# EAGLE design EIB A79024-001 (EAGLE 9.3.2)
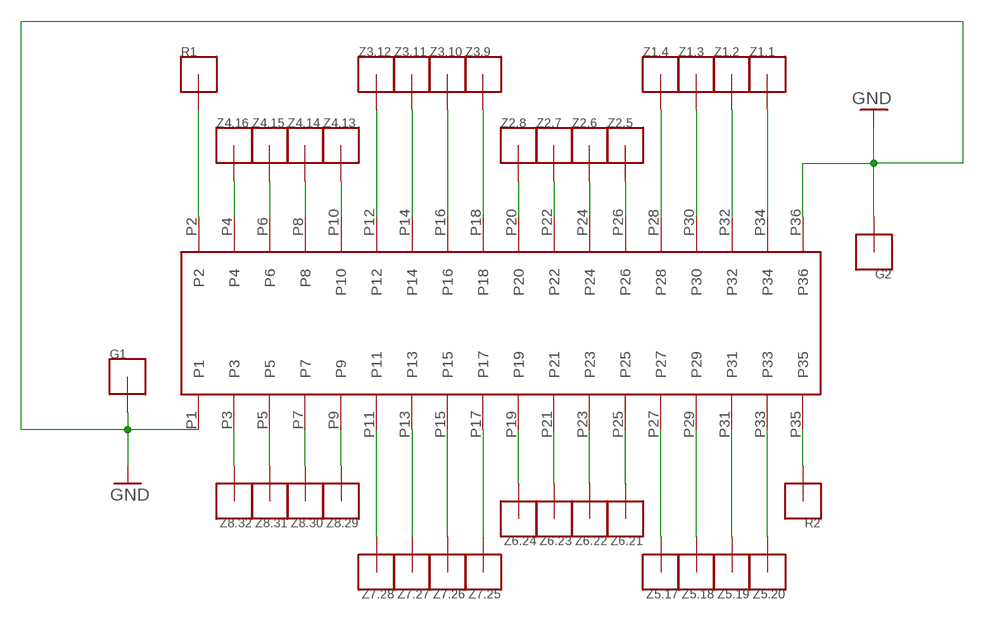
[diagram p0: schematic, sheet 1]

## Parts
A79024  OMNETICS  [A79024]
G1  S_P_HOLE  [S_P_HOLE]
G2  S_P_HOLE  [S_P_HOLE]
R1  S_P_HOLE  [S_P_HOLE]
R2  S_P_HOLE  [S_P_HOLE]
Z1.1  S_P_HOLE  [S_P_HOLE]
Z1.2  S_P_HOLE  [S_P_HOLE]
Z1.3  S_P_HOLE  [S_P_HOLE]
Z1.4  S_P_HOLE  [S_P_HOLE]
Z2.5  S_P_HOLE  [S_P_HOLE]
Z2.6  S_P_HOLE  [S_P_HOLE]
Z2.7  S_P_HOLE  [S_P_HOLE]
Z2.8  S_P_HOLE  [S_P_HOLE]
Z3.9  S_P_HOLE  [S_P_HOLE]
Z3.10  S_P_HOLE  [S_P_HOLE]
Z3.11  S_P_HOLE  [S_P_HOLE]
Z3.12  S_P_HOLE  [S_P_HOLE]
Z4.13  S_P_HOLE  [S_P_HOLE]
Z4.14  S_P_HOLE  [S_P_HOLE]
Z4.15  S_P_HOLE  [S_P_HOLE]
Z4.16  S_P_HOLE  [S_P_HOLE]
Z5.17  S_P_HOLE  [S_P_HOLE]
Z5.18  S_P_HOLE  [S_P_HOLE]
Z5.19  S_P_HOLE  [S_P_HOLE]
Z5.20  S_P_HOLE  [S_P_HOLE]
Z6.21  S_P_HOLE  [S_P_HOLE]
Z6.22  S_P_HOLE  [S_P_HOLE]
Z6.23  S_P_HOLE  [S_P_HOLE]
Z6.24  S_P_HOLE  [S_P_HOLE]
Z7.25  S_P_HOLE  [S_P_HOLE]
Z7.26  S_P_HOLE  [S_P_HOLE]
Z7.27  S_P_HOLE  [S_P_HOLE]
Z7.28  S_P_HOLE  [S_P_HOLE]
Z8.29  S_P_HOLE  [S_P_HOLE]
Z8.30  S_P_HOLE  [S_P_HOLE]
Z8.31  S_P_HOLE  [S_P_HOLE]
Z8.32  S_P_HOLE  [S_P_HOLE]

## Nets
GND: A79024.P1 A79024.P36 G1.P1 G2.P1
N$1: A79024.P20 Z2.8.P1
N$2: A79024.P22 Z2.7.P1
N$3: A79024.P24 Z2.6.P1
N$4: A79024.P26 Z2.5.P1
N$5: A79024.P4 Z4.16.P1
N$6: A79024.P6 Z4.15.P1
N$7: A79024.P8 Z4.14.P1
N$8: A79024.P10 Z4.13.P1
N$9: A79024.P12 Z3.12.P1
N$10: A79024.P14 Z3.11.P1
N$11: A79024.P16 Z3.10.P1
N$12: A79024.P18 Z3.9.P1
N$13: A79024.P28 Z1.4.P1
N$14: A79024.P30 Z1.3.P1
N$15: A79024.P32 Z1.2.P1
N$16: A79024.P34 Z1.1.P1
N$17: A79024.P2 R1.P1
N$18: A79024.P35 R2.P1
N$19: A79024.P3 Z8.32.P1
N$20: A79024.P5 Z8.31.P1
N$21: A79024.P7 Z8.30.P1
N$22: A79024.P9 Z8.29.P1
N$23: A79024.P11 Z7.28.P1
N$24: A79024.P13 Z7.27.P1
N$25: A79024.P15 Z7.26.P1
N$26: A79024.P17 Z7.25.P1
N$27: A79024.P19 Z6.24.P1
N$28: A79024.P21 Z6.23.P1
N$29: A79024.P23 Z6.22.P1
N$30: A79024.P25 Z6.21.P1
N$31: A79024.P27 Z5.17.P1
N$32: A79024.P29 Z5.18.P1
N$33: A79024.P31 Z5.19.P1
N$34: A79024.P33 Z5.20.P1

## Library data of the parts
A79024 = omnetics:OMNETICS
G1 G2 R1 R2 Z1.1-Z1.4 Z2.5-Z2.8 Z3.9-Z3.12 Z4.13-Z4.16 Z5.17-Z5.20 Z6.21-Z6.24 Z7.25-Z7.28 Z8.29-Z8.32 = omnetics:S_P_HOLE

## Board
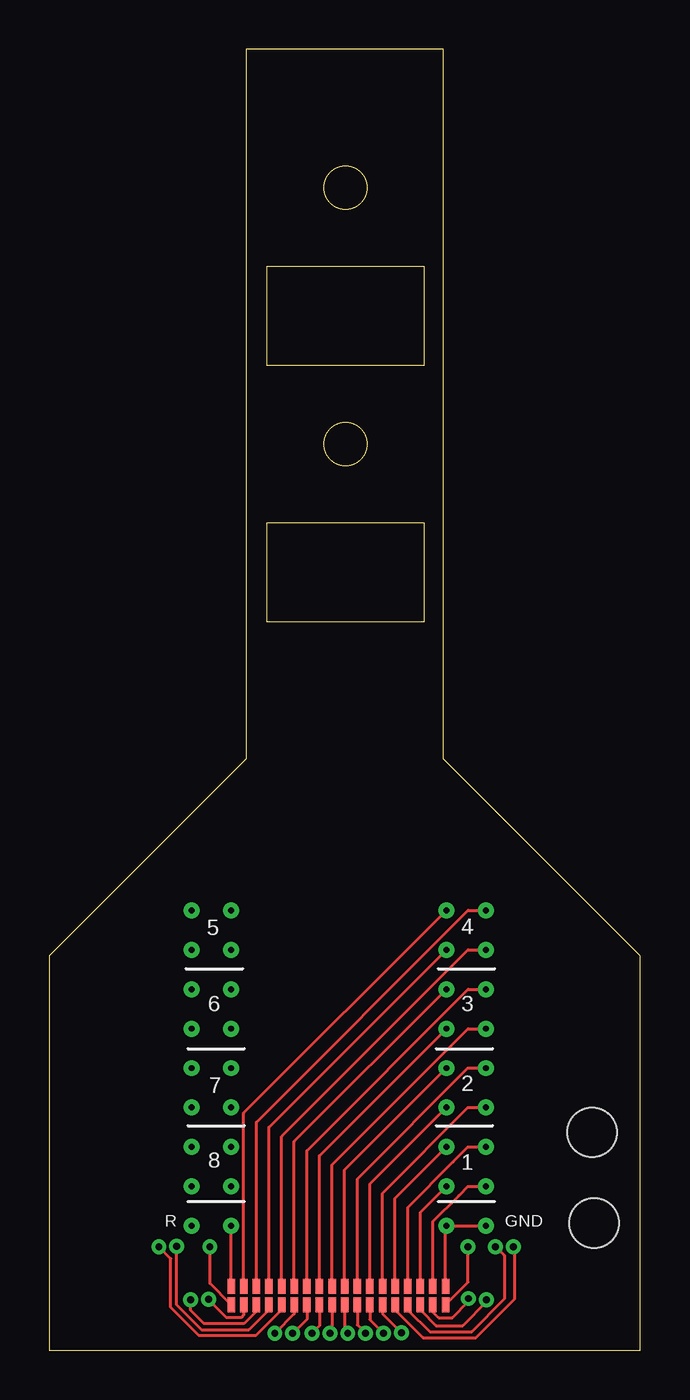
[diagram p1: board, top side]
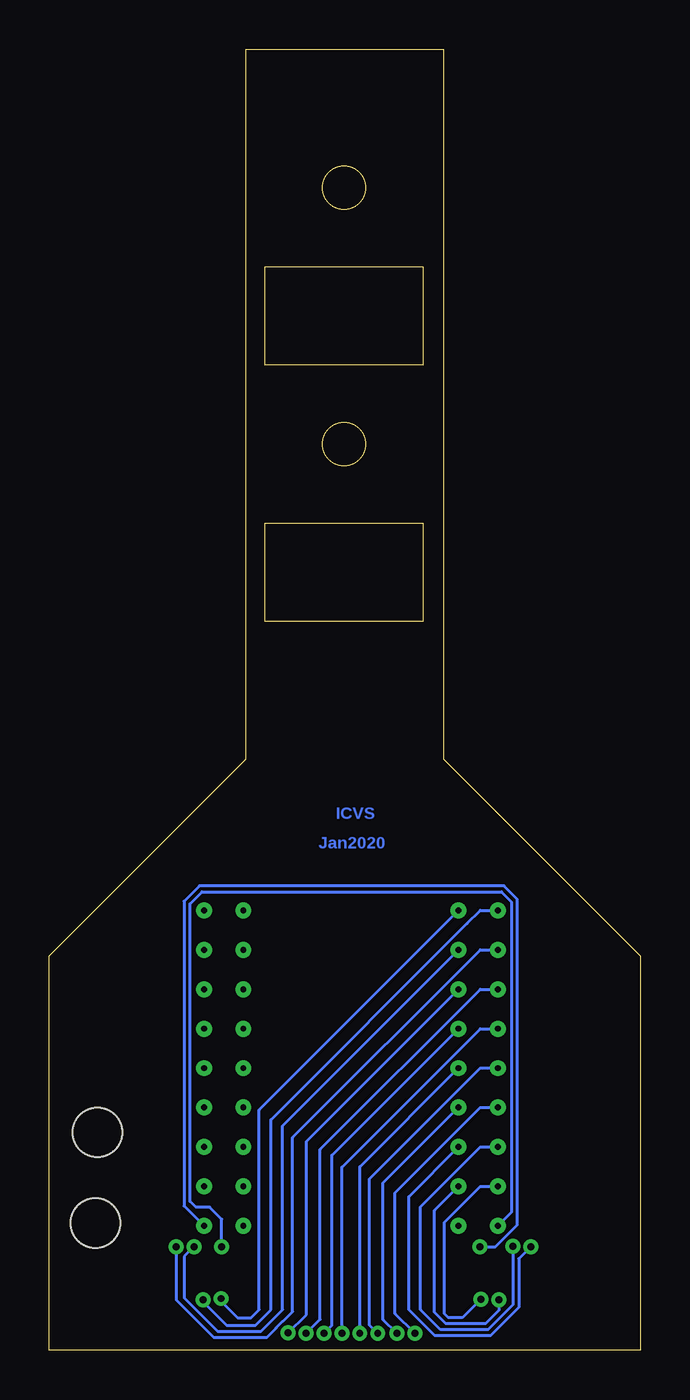
[diagram p2: board, bottom side, seen from below]

Size 30 x 66 mm. Coordinates in mm from the lower left corner, seen from the top.
Outline: 19.04,36.97 19.04,41.97 11.04,41.97 11.04,36.97 19.04,36.97
Outline: 19.04,49.97 19.04,54.97 11.04,54.97 11.04,49.97 19.04,49.97
Outline: 10,30 0,20 0,0 30,0 30,20 20,30 20,66 10,66 10,30
Outline: circle at 15.04,45.97 radius 1.1
Outline: circle at 15.04,58.97 radius 1.1
Copper layers (1*16): Top 0.035mm / dielectric 1.5mm / Bottom 0.035mm
Design rules "default": minimum track width 6mil, minimum drill 0.35mm, track to track 6mil, track to pad 6mil, pad to pad 6mil, via to via 6mil, smd to smd 6mil, copper to edge 40mil, drill to drill 6mil, minimum pad ring 10mil, minimum via ring 8mil, stop-mask expansion 4mil, vias tented up to drill 0mil, thermal gap 10mil
Holes 2.5 mm at 27.55,11.05 27.65,6.45

### Footprints (pad centres in the part's own frame; a part is rotated, then mirrored left to right if it is on the bottom)
A79024 = smd 0.38 x 0.76: P1 0,0; P2 0,0.94; P3 0.64,0; P4 0.64,0.94; P5 1.28,0; P6 1.28,0.94; P7 1.92,0; P8 1.92,0.94; P9 2.56,0; P10 2.56,0.94; P11 3.2,0; P12 3.2,0.94; P13 3.84,0; P14 3.84,0.94; P15 4.48,0; P16 4.48,0.94; P17 5.12,0; P18 5.12,0.94; P19 5.76,0; P20 5.76,0.94; P21 6.4,0; P22 6.4,0.94; P23 7.04,0; P24 7.04,0.94; P25 7.68,0; P26 7.68,0.94; P27 8.32,0; P28 8.32,0.94; P29 8.96,0; P30 8.96,0.94; P31 9.6,0; P32 9.6,0.94; P33 10.24,0; P34 10.24,0.94; P35 10.88,0; P36 10.88,0.94
S_P_HOLE = drill 0.3 pad 0.6: P1 0,0

### Placement (x,y rotation side)
A79024  9.23,2.31 0 top
G1  22.15,6.31 0 top
G2  20.15,6.31 0 top
R1  9.23,6.31 0 top
R2  7.23,6.31 0 top
Z1.1  22.15,8.31 0 top
Z1.2  20.15,8.31 0 top
Z1.3  22.15,10.31 0 top
Z1.4  20.15,10.31 0 top
Z2.5  22.15,12.31 0 top
Z2.6  20.15,12.31 0 top
Z2.7  22.15,14.31 0 top
Z2.8  20.15,14.31 0 top
Z3.9  22.15,16.31 0 top
Z3.10  20.15,16.31 0 top
Z3.11  22.15,18.31 0 top
Z3.12  20.15,18.31 0 top
Z4.13  22.15,20.31 0 top
Z4.14  20.15,20.31 0 top
Z4.15  22.15,22.31 0 top
Z4.16  20.15,22.31 0 top
Z5.17  7.23,20.31 0 top
Z5.18  9.23,20.31 0 top
Z5.19  7.23,22.31 0 top
Z5.20  9.23,22.31 0 top
Z6.21  9.23,18.31 0 top
Z6.22  7.23,18.31 0 top
Z6.23  9.23,16.31 0 top
Z6.24  7.23,16.31 0 top
Z7.25  9.23,14.31 0 top
Z7.26  7.23,14.31 0 top
Z7.27  9.23,12.31 0 top
Z7.28  7.23,12.31 0 top
Z8.29  9.23,10.31 0 top
Z8.30  7.23,10.31 0 top
Z8.31  9.23,8.31 0 top
Z8.32  7.23,8.31 0 top

### Tracks (layer width: path | path; a pad name or v marks a point on that pad's centre or on a via)
GND  (via drill 0.35)
  Top 0.152: A79024.P36 20.11,6.27 G2.P1 G1.P1 | A79024.P1 8.15,3.39 v8.15,5.25
  Bottom 0.152: v8.15,5.25 7.35,5.25 6.25,6.36 6.25,22.88 6.93,23.56 22.38,23.56 23.16,22.78 23.16,7.32 G1.P1
N$1
  Top 0.152: A79024.P20 14.99,9.15 Z2.8.P1
N$2
  Top 0.152: Z2.7.P1 21.26,14.31 15.63,8.69 A79024.P22
N$3
  Top 0.152: A79024.P24 16.27,8.43 Z2.6.P1
N$4
  Top 0.152: Z2.5.P1 21.26,12.31 16.91,7.97 A79024.P26
N$5
  Top 0.152: A79024.P4 9.87,12.03 Z4.16.P1
N$6
  Top 0.152: Z4.15.P1 21.26,22.31 10.51,11.57 A79024.P6
N$7
  Top 0.152: A79024.P8 11.15,11.31 Z4.14.P1
N$8
  Top 0.152: Z4.13.P1 21.26,20.31 11.79,10.85 A79024.P10
N$9
  Top 0.152: A79024.P12 12.43,10.59 Z3.12.P1
N$10
  Top 0.152: Z3.11.P1 21.26,18.31 13.07,10.13 A79024.P14
N$11
  Top 0.152: A79024.P16 13.71,9.87 Z3.10.P1
N$12
  Top 0.152: Z3.9.P1 21.26,16.31 14.35,9.41 A79024.P18
N$13
  Top 0.152: A79024.P28 17.55,7.71 Z1.4.P1
N$14
  Top 0.152: Z1.3.P1 21.25,10.31 20.48,9.55 20.49,9.55 18.19,7.25 A79024.P30
N$15
  Top 0.152: A79024.P32 18.83,6.99 Z1.2.P1
N$16
  Top 0.152: Z1.1.P1 21.25,8.31 20.78,7.85 20.79,7.85 19.47,6.53 A79024.P34
N$17
  Top 0.152: A79024.P2 R1.P1
N$18  (via drill 0.35)
  Top 0.152: A79024.P35 21.25,3.45 v21.25,5.25
  Bottom 0.152: v21.25,5.25 21.25,6.65 21.85,7.25 22.55,7.25 22.85,7.55 22.85,22.65 22.25,23.25 7.05,23.25 6.55,22.75 6.55,6.99 R2.P1
N$19  (via drill 0.35)
  Top 0.152: A79024.P3 9.87,1.77 9.75,1.65 9,1.65 8.09,2.56 v8.09,2.59
  Bottom 0.152: v8.09,2.59 9.03,1.65 9.75,1.65 9.95,1.85 9.95,6.49 8.13,8.31 Z8.32.P1
N$20  (via drill 0.35)
  Top 0.152: A79024.P5 10.49,2.29 10.49,1.96 9.88,1.35 8.87,1.35 7.85,1.35 7.18,2.02 v7.18,2.55
  Bottom 0.152: v7.18,2.55 7.18,2.02 7.86,1.35 9.88,1.35 10.45,1.92 10.45,7.09 Z8.31.P1
N$21  (via drill 0.35)
  Top 0.152: A79024.P7 11.15,2.01 11.13,1.99 11.13,2.04 10.14,1.04 7.73,1.04 6.47,2.3 v6.47,5.27
  Bottom 0.152: v6.47,5.27 6.47,2.3 7.73,1.04 10.14,1.04 11.15,2.05 11.15,7.29 9.49,8.95 9.5,8.95 8.13,10.31 Z8.30.P1
N$22  (via drill 0.35)
  Top 0.152: v5.56,5.25 6.17,4.65 6.17,2.18 7.6,0.74 10.47,0.74 11.79,2.06 A79024.P9
  Bottom 0.152: v5.56,5.25 6.17,4.65 6.17,2.18 7.6,0.74 10.44,0.74 11.76,2.06 11.76,7.79 Z8.29.P1
N$23  (via drill 0.35)
  Top 0.152: A79024.P11 12.43,1.84 v11.45,0.86
  Bottom 0.152: Z7.28.P1 8.13,12.31 12.45,8 12.45,1.86 v11.45,0.86
N$24  (via drill 0.35)
  Top 0.152: A79024.P13 13.07,1.56 12.56,1.04 12.55,1.04 v12.36,0.85
  Bottom 0.152: v12.36,0.85 13.05,1.55 13.05,8.49 Z7.27.P1
N$25  (via drill 0.35)
  Top 0.152: A79024.P15 13.71,1.23 v13.33,0.85
  Bottom 0.152: v13.33,0.85 13.75,1.27 13.75,8.69 8.13,14.31 Z7.26.P1
N$26  (via drill 0.35)
  Top 0.152: A79024.P17 14.35,0.96 v14.24,0.85
  Bottom 0.152: v14.24,0.85 14.24,9.3 Z7.25.P1
N$27  (via drill 0.35)
  Top 0.152: A79024.P19 14.99,1.01 v15.15,0.85
  Bottom 0.152: Z6.24.P1 8.13,16.31 15.15,9.29 v15.15,0.85
N$28  (via drill 0.35)
  Top 0.152: A79024.P21 15.63,1.28 v16.06,0.85
  Bottom 0.152: v16.06,0.85 15.65,1.26 15.65,9.89 Z6.23.P1
N$29  (via drill 0.35)
  Top 0.152: A79024.P23 16.27,1.55 v16.97,0.85
  Bottom 0.152: v16.97,0.85 16.25,1.57 16.25,10.19 8.13,18.31 Z6.22.P1
N$30  (via drill 0.35)
  Top 0.152: A79024.P25 16.91,1.84 v17.88,0.88
  Bottom 0.152: v17.88,0.88 16.95,1.8 16.95,10.59 Z6.21.P1
N$31  (via drill 0.35)
  Top 0.152: A79024.P27 17.55,2.06 18.97,0.64 21.66,0.64 23.6,2.58 23.6,5.21 v23.56,5.25
  Bottom 0.152: v23.56,5.25 23.56,4.85 23.55,4.84 23.55,2.55 21.65,0.65 18.95,0.65 18.48,1.12 18.48,1.13 18.13,1.48 18.12,1.48 17.65,1.95 17.65,10.79 8.13,20.31 Z5.17.P1
N$32  (via drill 0.35)
  Top 0.152: A79024.P29 18.21,2.29 18.21,2.04 19.31,0.94 21.44,0.94 23.1,2.6 23.1,4.81 v22.65,5.25
  Bottom 0.152: v22.65,5.25 23.15,4.75 23.15,2.66 21.45,0.96 19.25,0.96 18.15,2.06 18.15,11.39 Z5.18.P1
N$33  (via drill 0.35)
  Top 0.152: A79024.P31 18.85,2.29 18.85,2.02 19.63,1.25 20.98,1.25 22.19,2.45 v22.19,2.55
  Bottom 0.152: v22.19,2.55 22.19,2.45 21,1.26 19.54,1.26 18.75,2.05 18.75,11.69 8.79,21.65 8.8,21.65 8.13,22.31 Z5.19.P1
N$34  (via drill 0.35)
  Top 0.152: A79024.P33 19.47,1.93 19.75,1.65 20.45,1.65 21.28,2.48 v21.28,2.62
  Bottom 0.152: v21.28,2.62 21.28,2.48 20.45,1.65 19.75,1.65 19.35,2.05 19.35,12.19 Z5.20.P1

### Text on the board
Bottom: ICVS | Jan2020
tNames: 5 | 4 | 6 | 3 | 7 | 2 | 8 | 1 | R | GND